# Altium schematic sheet GPIO.SchDoc
size 594 x 420 mm
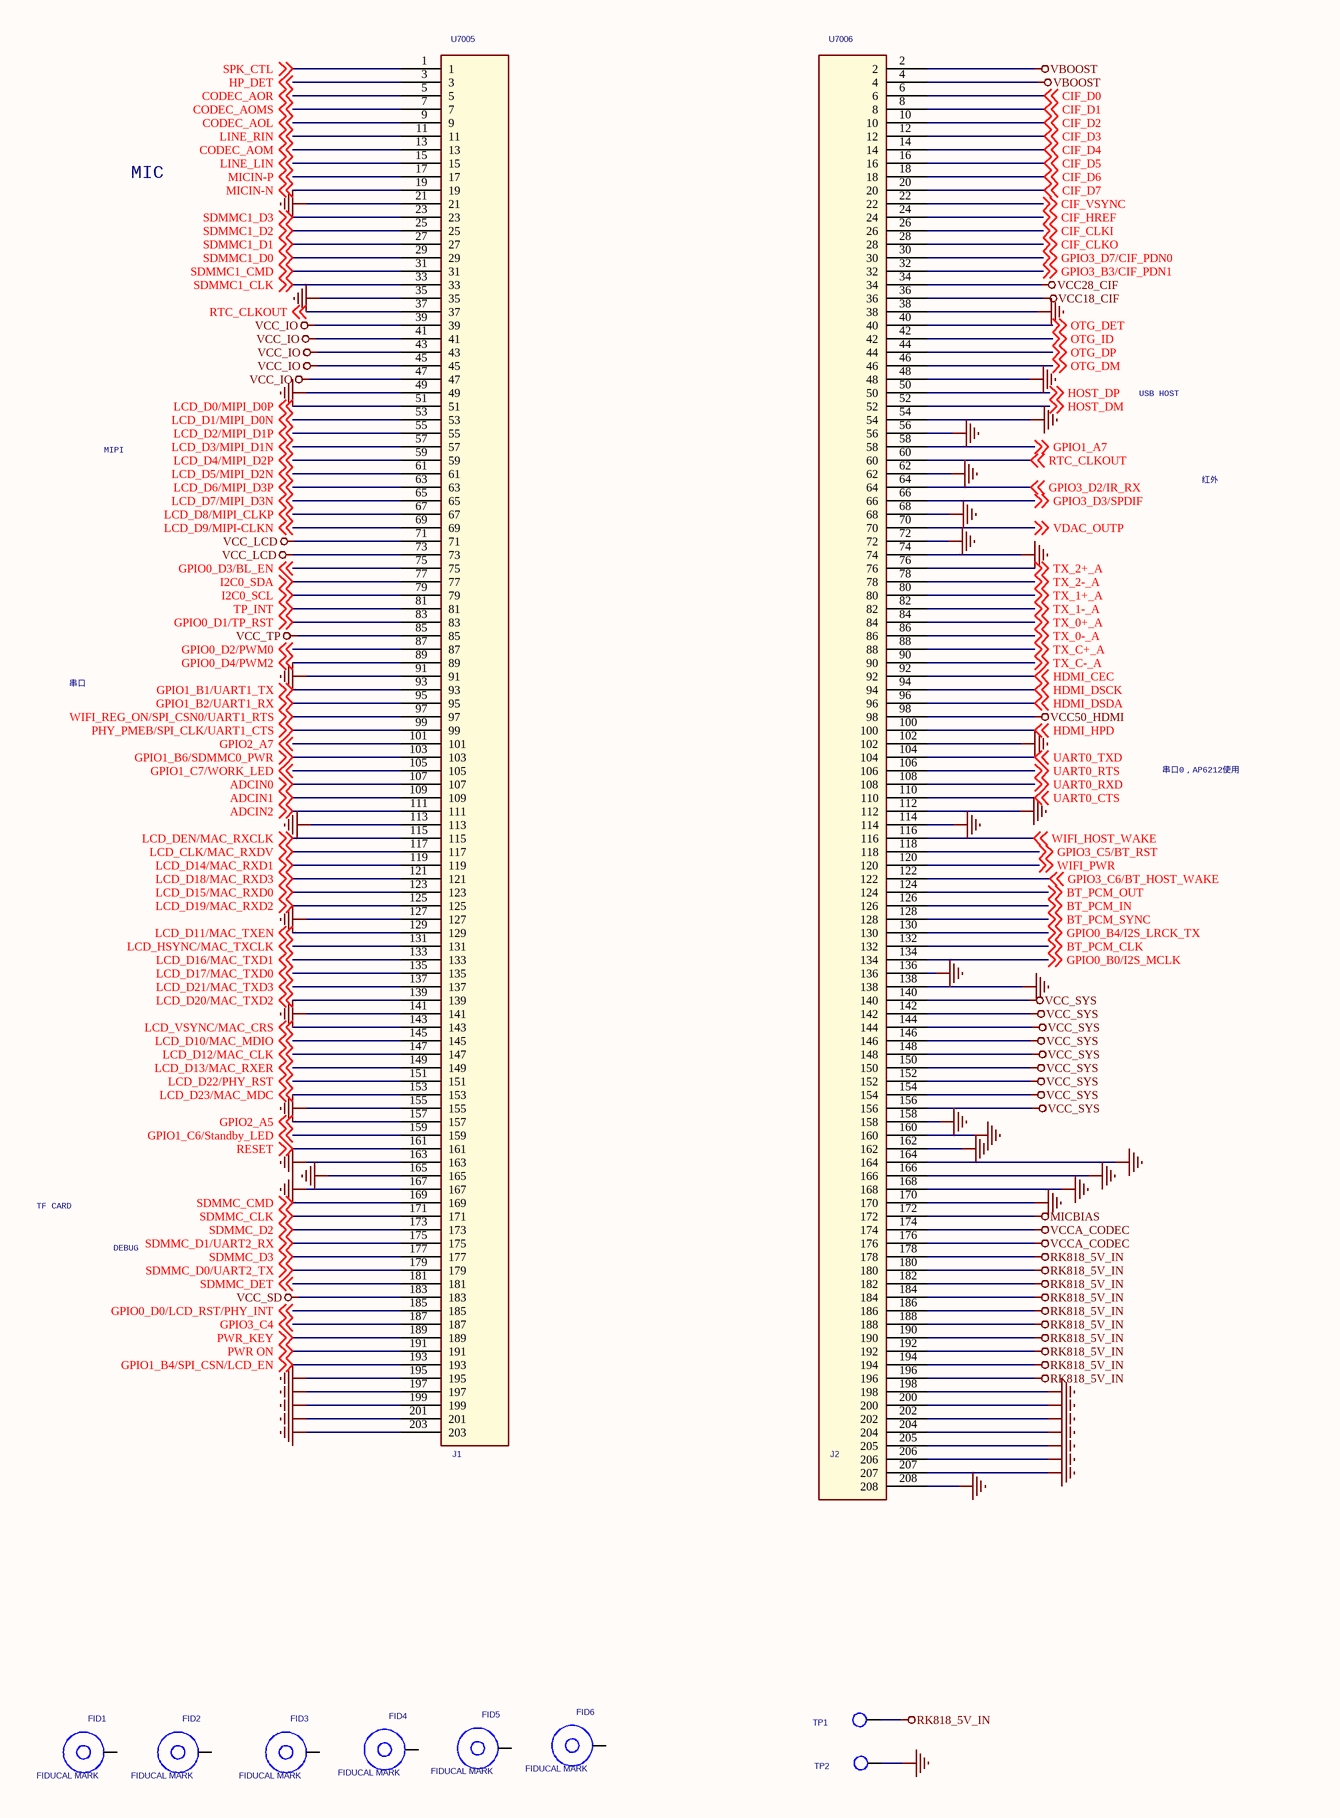
[diagram p0: GPIO.SchDoc, left]
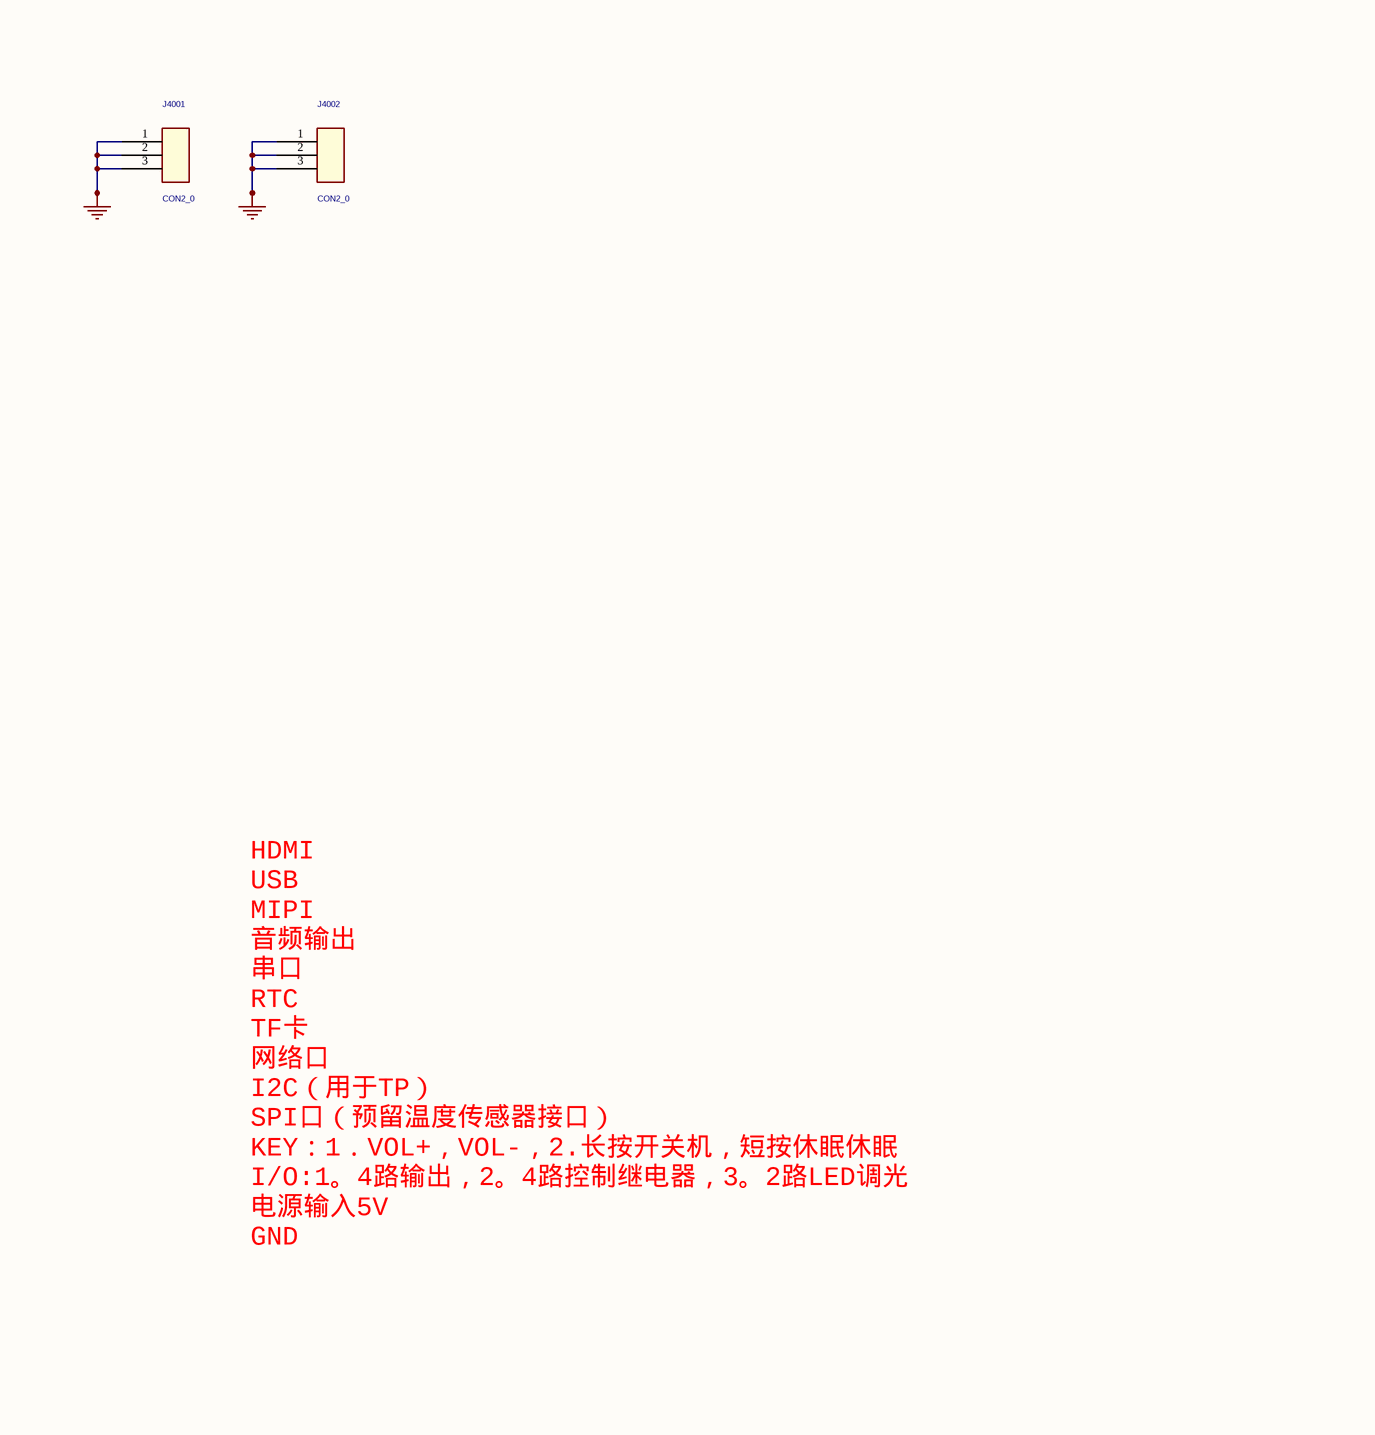
[diagram p1: GPIO.SchDoc, right]

## Parts
FID1  FIDUCAL MARK  [FIDICALMARK]
FID2  FIDUCAL MARK  [FIDICALMARK]
FID3  FIDUCAL MARK  [FIDICALMARK]
FID4  FIDUCAL MARK  [FIDICALMARK]
FID5  FIDUCAL MARK  [FIDICALMARK]
FID6  FIDUCAL MARK  [FIDICALMARK]
J4001  CON2_0  [PAD_0D8X6D5_1]
J4002  CON2_0  [PAD_0D8X6D5_1]
TP1  T_POINT_R  [TP_PAD]  (value not drawn)
TP2  T_POINT_R  [TP_PAD]  (value not drawn)
U7005  J1  [2013311-1]
U7006  J2  [2013311-2]

## Nets
GND: J4001.1 J4001.2 J4001.3 J4002.1 J4002.2 J4002.3 TP2.1(TP) U7005.21 U7005.35 U7005.49 U7005.91 U7005.113 U7005.127 U7005.141 U7005.155 U7005.163 U7005.165 U7005.167 U7005.195 U7005.197 U7005.199 U7005.201 U7005.203 U7006.38 U7006.48 U7006.54 U7006.56 U7006.62 U7006.68 U7006.72 U7006.74 U7006.102 U7006.112 U7006.114 U7006.136 U7006.138 U7006.158 U7006.160 U7006.162 U7006.164 U7006.166 U7006.168 U7006.170 U7006.198 U7006.200 U7006.202 U7006.204 U7006.205 U7006.206 U7006.207 U7006.208
MICBIAS: U7006.172
RK818_5V_IN: TP1.1(TP) U7006.178 U7006.180 U7006.182 U7006.184 U7006.186 U7006.188 U7006.190 U7006.192 U7006.194 U7006.196
VBOOST: U7006.2 U7006.4
VCC18_CIF: U7006.36
VCC28_CIF: U7006.34
VCC50_HDMI: U7006.98
VCC_IO: U7005.39 U7005.41 U7005.43 U7005.45 U7005.47
VCC_LCD: U7005.71 U7005.73
VCC_SD: U7005.183
VCC_SYS: U7006.140 U7006.142 U7006.144 U7006.146 U7006.148 U7006.150 U7006.152 U7006.154 U7006.156
VCC_TP: U7005.85
VCCA_CODEC: U7006.174 U7006.176
ADCIN0: U7005.107 ; off-sheet ADCIN0
ADCIN1: U7005.109 ; off-sheet ADCIN1
ADCIN2: U7005.111 ; off-sheet ADCIN2
BT_PCM_CLK: U7006.132 ; off-sheet BT_PCM_CLK
BT_PCM_IN: U7006.126 ; off-sheet BT_PCM_IN
BT_PCM_OUT: U7006.124 ; off-sheet BT_PCM_OUT
BT_PCM_SYNC: U7006.128 ; off-sheet BT_PCM_SYNC
CIF_CLKI: U7006.26 ; off-sheet CIF_CLKI
CIF_CLKO: U7006.28 ; off-sheet CIF_CLKO
CIF_D0: U7006.6 ; off-sheet CIF_D0
CIF_D1: U7006.8 ; off-sheet CIF_D1
CIF_D2: U7006.10 ; off-sheet CIF_D2
CIF_D3: U7006.12 ; off-sheet CIF_D3
CIF_D4: U7006.14 ; off-sheet CIF_D4
CIF_D5: U7006.16 ; off-sheet CIF_D5
CIF_D6: U7006.18 ; off-sheet CIF_D6
CIF_D7: U7006.20 ; off-sheet CIF_D7
CIF_HREF: U7006.24 ; off-sheet CIF_HREF
CIF_VSYNC: U7006.22 ; off-sheet CIF_VSYNC
CODEC_AOL: U7005.9 ; off-sheet CODEC_AOL
CODEC_AOM: U7005.13 ; off-sheet CODEC_AOM
CODEC_AOMS: U7005.7 ; off-sheet CODEC_AOMS
CODEC_AOR: U7005.5 ; off-sheet CODEC_AOR
GPIO0_B0/I2S_MCLK: U7006.134 ; off-sheet GPIO0_B0/I2S_MCLK
GPIO0_B4/I2S_LRCK_TX: U7006.130 ; off-sheet GPIO0_B4/I2S_LRCK_TX
GPIO0_D0/LCD_RST/PHY_INT: U7005.185 ; off-sheet GPIO0_D0/LCD_RST/PHY_INT
GPIO0_D1/TP_RST: U7005.83 ; off-sheet GPIO0_D1/TP_RST
GPIO0_D2/PWM0: U7005.87 ; off-sheet GPIO0_D2/PWM0
GPIO0_D3/BL_EN: U7005.75 ; off-sheet GPIO0_D3/BL_EN
GPIO0_D4/PWM2: U7005.89 ; off-sheet GPIO0_D4/PWM2
GPIO1_A7: U7006.58 ; off-sheet GPIO1_A7
GPIO1_B1/UART1_TX: U7005.93 ; off-sheet GPIO1_B1/UART1_TX
GPIO1_B2/UART1_RX: U7005.95 ; off-sheet GPIO1_B2/UART1_RX
GPIO1_B4/SPI_CSN/LCD_EN: U7005.193 ; off-sheet GPIO1_B4/SPI_CSN/LCD_EN
GPIO1_B6/SDMMC0_PWR: U7005.103 ; off-sheet GPIO1_B6/SDMMC0_PWR
GPIO1_C6/Standby_LED: U7005.159 ; off-sheet GPIO1_C6/Standby_LED
GPIO1_C7/WORK_LED: U7005.105 ; off-sheet GPIO1_C7/WORK_LED
GPIO2_A5: U7005.157 ; off-sheet GPIO2_A5
GPIO2_A7: U7005.101 ; off-sheet GPIO2_A7
GPIO3_B3/CIF_PDN1: U7006.32 ; off-sheet GPIO3_B3/CIF_PDN1
GPIO3_C4: U7005.187 ; off-sheet GPIO3_C4
GPIO3_C5/BT_RST: U7006.118 ; off-sheet GPIO3_C5/BT_RST
GPIO3_C6/BT_HOST_WAKE: U7006.122 ; off-sheet GPIO3_C6/BT_HOST_WAKE
GPIO3_D2/IR_RX: U7006.64 ; off-sheet GPIO3_D2/IR_RX
GPIO3_D3/SPDIF: U7006.66 ; off-sheet GPIO3_D3/SPDIF
GPIO3_D7/CIF_PDN0: U7006.30 ; off-sheet GPIO3_D7/CIF_PDN0
HDMI_CEC: U7006.92 ; off-sheet HDMI_CEC
HDMI_DSCK: U7006.94 ; off-sheet HDMI_DSCK
HDMI_DSDA: U7006.96 ; off-sheet HDMI_DSDA
HDMI_HPD: U7006.100 ; off-sheet HDMI_HPD
HOST_DM: U7006.52 ; off-sheet HOST_DM
HOST_DP: U7006.50 ; off-sheet HOST_DP
HP_DET: U7005.3 ; off-sheet HP_DET
I2C0_SCL: U7005.79 ; off-sheet I2C0_SCL
I2C0_SDA: U7005.77 ; off-sheet I2C0_SDA
LCD_CLK/MAC_RXDV: U7005.117 ; off-sheet LCD_CLK/MAC_RXDV
LCD_D0/MIPI_D0P: U7005.51 ; off-sheet LCD_D0/MIPI_D0P
LCD_D1/MIPI_D0N: U7005.53 ; off-sheet LCD_D1/MIPI_D0N
LCD_D2/MIPI_D1P: U7005.55 ; off-sheet LCD_D2/MIPI_D1P
LCD_D3/MIPI_D1N: U7005.57 ; off-sheet LCD_D3/MIPI_D1N
LCD_D4/MIPI_D2P: U7005.59 ; off-sheet LCD_D4/MIPI_D2P
LCD_D5/MIPI_D2N: U7005.61 ; off-sheet LCD_D5/MIPI_D2N
LCD_D6/MIPI_D3P: U7005.63 ; off-sheet LCD_D6/MIPI_D3P
LCD_D7/MIPI_D3N: U7005.65 ; off-sheet LCD_D7/MIPI_D3N
LCD_D8/MIPI_CLKP: U7005.67 ; off-sheet LCD_D8/MIPI_CLKP
LCD_D9/MIPI-CLKN: U7005.69 ; off-sheet LCD_D9/MIPI-CLKN
LCD_D10/MAC_MDIO: U7005.145 ; off-sheet LCD_D10/MAC_MDIO
LCD_D11/MAC_TXEN: U7005.129 ; off-sheet LCD_D11/MAC_TXEN
LCD_D12/MAC_CLK: U7005.147 ; off-sheet LCD_D12/MAC_CLK
LCD_D13/MAC_RXER: U7005.149 ; off-sheet LCD_D13/MAC_RXER
LCD_D14/MAC_RXD1: U7005.119 ; off-sheet LCD_D14/MAC_RXD1
LCD_D15/MAC_RXD0: U7005.123 ; off-sheet LCD_D15/MAC_RXD0
LCD_D16/MAC_TXD1: U7005.133 ; off-sheet LCD_D16/MAC_TXD1
LCD_D17/MAC_TXD0: U7005.135 ; off-sheet LCD_D17/MAC_TXD0
LCD_D18/MAC_RXD3: U7005.121 ; off-sheet LCD_D18/MAC_RXD3
LCD_D19/MAC_RXD2: U7005.125 ; off-sheet LCD_D19/MAC_RXD2
LCD_D20/MAC_TXD2: U7005.139 ; off-sheet LCD_D20/MAC_TXD2
LCD_D21/MAC_TXD3: U7005.137 ; off-sheet LCD_D21/MAC_TXD3
LCD_D22/PHY_RST: U7005.151 ; off-sheet LCD_D22/PHY_RST
LCD_D23/MAC_MDC: U7005.153 ; off-sheet LCD_D23/MAC_MDC
LCD_DEN/MAC_RXCLK: U7005.115 ; off-sheet LCD_DEN/MAC_RXCLK
LCD_HSYNC/MAC_TXCLK: U7005.131 ; off-sheet LCD_HSYNC/MAC_TXCLK
LCD_VSYNC/MAC_CRS: U7005.143 ; off-sheet LCD_VSYNC/MAC_CRS
LINE_LIN: U7005.15 ; off-sheet LINE_LIN
LINE_RIN: U7005.11 ; off-sheet LINE_RIN
MICIN-N: U7005.19 ; off-sheet MICIN-N
MICIN-P: U7005.17 ; off-sheet MICIN-P
OTG_DET: U7006.40 ; off-sheet OTG_DET
OTG_DM: U7006.46 ; off-sheet OTG_DM
OTG_DP: U7006.44 ; off-sheet OTG_DP
OTG_ID: U7006.42 ; off-sheet OTG_ID
PHY_PMEB/SPI_CLK/UART1_CTS: U7005.99 ; off-sheet PHY_PMEB/SPI_CLK/UART1_CTS
PWR ON: U7005.191 ; off-sheet PWR ON
PWR_KEY: U7005.189 ; off-sheet PWR_KEY
RESET: U7005.161 ; off-sheet RESET
RTC_CLKOUT: U7005.37 U7006.60 ; off-sheet RTC_CLKOUT
SDMMC1_CLK: U7005.33 ; off-sheet SDMMC1_CLK
SDMMC1_CMD: U7005.31 ; off-sheet SDMMC1_CMD
SDMMC1_D0: U7005.29 ; off-sheet SDMMC1_D0
SDMMC1_D1: U7005.27 ; off-sheet SDMMC1_D1
SDMMC1_D2: U7005.25 ; off-sheet SDMMC1_D2
SDMMC1_D3: U7005.23 ; off-sheet SDMMC1_D3
SDMMC_CLK: U7005.171 ; off-sheet SDMMC_CLK
SDMMC_CMD: U7005.169 ; off-sheet SDMMC_CMD
SDMMC_D0/UART2_TX: U7005.179 ; off-sheet SDMMC_D0/UART2_TX
SDMMC_D1/UART2_RX: U7005.175 ; off-sheet SDMMC_D1/UART2_RX
SDMMC_D2: U7005.173 ; off-sheet SDMMC_D2
SDMMC_D3: U7005.177 ; off-sheet SDMMC_D3
SDMMC_DET: U7005.181 ; off-sheet SDMMC_DET
SPK_CTL: U7005.1 ; off-sheet SPK_CTL
TP_INT: U7005.81 ; off-sheet TP_INT
TX_0+_A: U7006.84 ; off-sheet TX_0+_A
TX_0-_A: U7006.86 ; off-sheet TX_0-_A
TX_1+_A: U7006.80 ; off-sheet TX_1+_A
TX_1-_A: U7006.82 ; off-sheet TX_1-_A
TX_2+_A: U7006.76 ; off-sheet TX_2+_A
TX_2-_A: U7006.78 ; off-sheet TX_2-_A
TX_C+_A: U7006.88 ; off-sheet TX_C+_A
TX_C-_A: U7006.90 ; off-sheet TX_C-_A
UART0_CTS: U7006.110 ; off-sheet UART0_CTS
UART0_RTS: U7006.106 ; off-sheet UART0_RTS
UART0_RXD: U7006.108 ; off-sheet UART0_RXD
UART0_TXD: U7006.104 ; off-sheet UART0_TXD
VDAC_OUTP: U7006.70 ; off-sheet VDAC_OUTP
WIFI_HOST_WAKE: U7006.116 ; off-sheet WIFI_HOST_WAKE
WIFI_PWR: U7006.120 ; off-sheet WIFI_PWR
WIFI_REG_ON/SPI_CSN0/UART1_RTS: U7005.97 ; off-sheet WIFI_REG_ON/SPI_CSN0/UART1_RTS

Not connected (* = marked no-connect by the designer): FID1 1(TP); FID2 1(TP); FID3 1(TP); FID4 1(TP); FID5 1(TP); FID6 1(TP)

## Notes on the sheet
- MIC
- USB HOST
- MIPI
- 红外
- 串口
- 串口0，AP6212使用
- TF CARD
- DEBUG
- HDMI
  USB
  MIPI
  音频输出
  串口
  RTC
  TF卡
  网络口
  I2C（用于TP）
  SPI口（预留温度传感器接口）
  KEY：1．VOL+，VOL-，2.长按开关机，短按休眠休眠
  I/O:1。4路输出，2。4路控制继电器，3。2路LED调光
  电源输入5V
  GND

## Library data of the parts
FID1-FID6 = T POINT R_2: COMPONENT_WEIGHT: 30
J4001 J4002 = CON2_1
U7005 = J1_0
U7006 = J2_1